# EAGLE design HEAT (EAGLE 9.4.2)
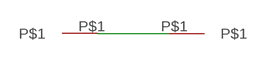
[diagram p0: schematic, sheet 1]

## Parts
U$1  PAD  [PAD]
U$2  PAD  [PAD]

## Nets
N$1: U$1.P$1 U$2.P$1

## Library data of the parts
U$1 U$2 = CanCubeSat:PAD

## Board
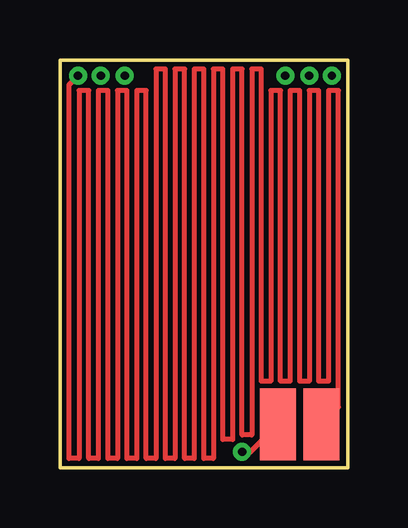
[diagram p1: board, top side]
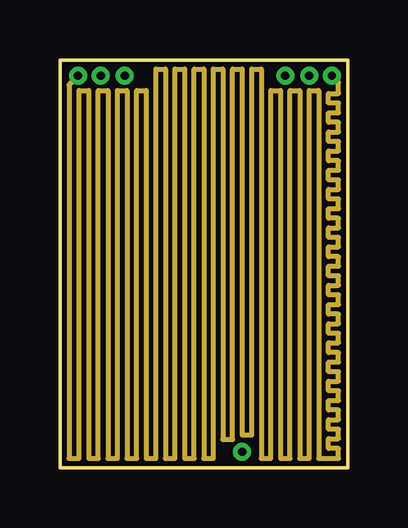
[diagram p2: board, inner layer Route2]
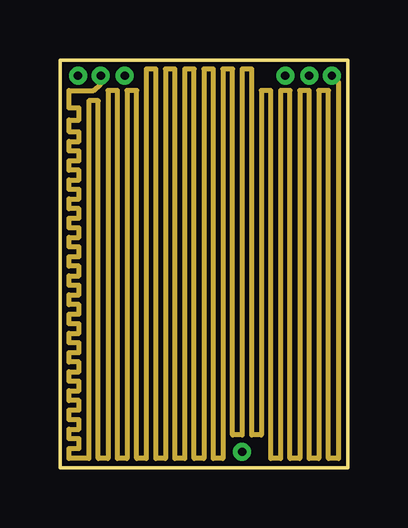
[diagram p3: board, inner layer Route3]
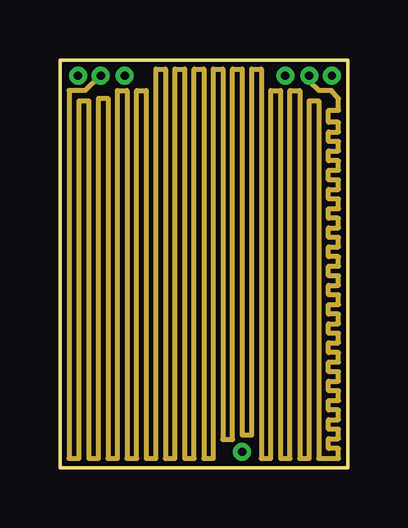
[diagram p4: board, inner layer Route4]
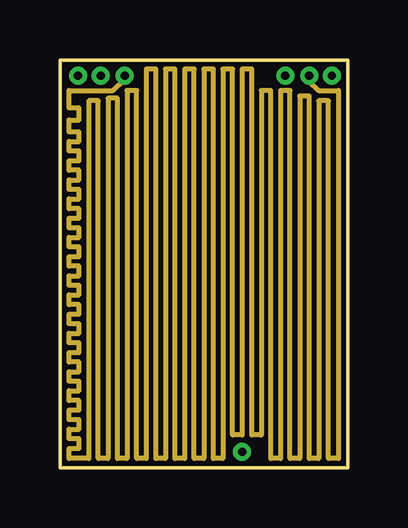
[diagram p5: board, inner layer Route5]
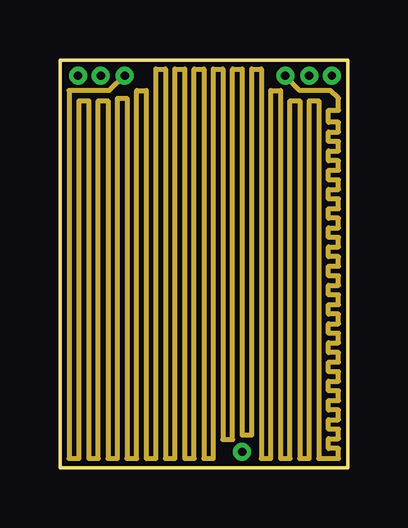
[diagram p6: board, inner layer Route6]
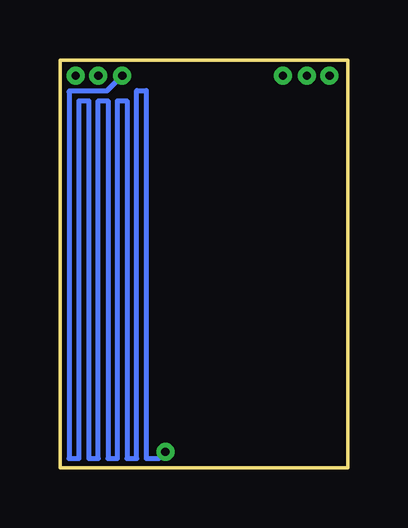
[diagram p7: board, bottom side, seen from below]

Size 12 x 17 mm. Coordinates in mm from the lower left corner, seen from the top.
Outline: 0,0 0,17 12,17 12,0 0,0
Copper layers (1+2+3+4+5+6+16): Top 0.018mm / dielectric 1.5mm / Route2 0.018mm / dielectric 0.15mm / Route3 0.018mm / dielectric 0.2mm / Route4 0.018mm / dielectric 0.15mm / Route5 0.018mm / dielectric 0.2mm / Route6 0.018mm / dielectric 0.15mm / Bottom 0.018mm
Design rules "default *": minimum track width 0.25mil, minimum drill 0.35mm, track to track 0.2mm, track to pad 0.2mm, pad to pad 0.2mm, via to via 0.2mm, smd to smd 0.2mm, copper to edge 0.2mm, drill to drill 0.1mm, minimum pad ring 10mil, minimum via ring 8mil, stop-mask expansion 4mil, vias tented up to drill 0mil, thermal gap 10mil

### Footprints (pad centres in the part's own frame; a part is rotated, then mirrored left to right if it is on the bottom)
PAD = smd 1.5 x 3: P$1 0,0

### Placement (x,y rotation side)
U$1  10.9,1.8 0 top
U$2  9.1,1.8 0 top

### Tracks (layer width: path | path; a pad name or v marks a point on that pad's centre or on a via)
N$1  (via drill 0.35)
  Top 0.2: U$1.P$1 11.62,2.52 11.62,15.72 11.2,15.72 11.2,3.6 10.8,3.6 10.8,15.72 10.4,15.72 10.4,3.6 10,3.6 10,15.72 9.6,15.72 9.6,3.6 9.2,3.6 9.2,15.72 8.8,15.72 8.8,3.6 8.4,3.6 8.4,16.62 8,16.62 8,1.36 7.6,1.36 7.6,16.62 7.2,16.62 7.2,1.18 6.8,1.18 6.8,16.62 6.4,16.62 6.4,0.38 6,0.38 6,16.62 5.6,16.62 5.6,0.38 5.2,0.38 5.2,16.62 4.8,16.62 4.8,0.38 4.4,0.38 4.4,16.62 4,16.62 4,0.38 3.6,0.38 3.6,15.72 3.2,15.72 3.2,0.38 2.8,0.38 2.8,15.72 2.4,15.72 2.4,0.38 2,0.38 2,15.72 1.6,15.72 1.6,0.38 1.2,0.38 1.2,15.72 0.8,15.72 0.8,0.38 0.38,0.38 0.38,15.97 v0.75,16.35 | v7.6,0.65 7.95,0.65 U$2.P$1
  Route2 0.2: v0.75,16.35 0.38,15.97 0.38,0.38 0.8,0.38 0.8,15.72 1.2,15.72 1.2,0.38 1.6,0.38 1.6,15.72 2,15.72 2,0.38 2.4,0.38 2.4,15.72 2.8,15.72 2.8,0.38 3.2,0.38 3.2,15.72 3.6,15.72 3.6,0.38 4,0.38 4,16.62 4.4,16.62 4.4,0.38 4.8,0.38 4.8,16.62 5.2,16.62 5.2,0.38 5.6,0.38 5.6,16.62 6,16.62 6,0.38 6.4,0.38 6.4,16.62 6.8,16.62 6.8,1.18 7.2,1.18 7.2,16.62 7.6,16.62 7.6,1.36 8,1.36 8,16.62 8.4,16.62 8.4,0.38 8.8,0.38 8.8,15.72 9.2,15.72 9.2,0.38 9.6,0.38 9.6,15.72 10,15.72 10,0.38 10.4,0.38 10.4,15.72 10.8,15.72 10.8,0.38 11.62,0.38 11.62,0.8 11.2,0.8 11.2,1.2 11.62,1.2 11.62,1.6 11.2,1.6 11.2,2 11.62,2 11.62,2.4 11.2,2.4 11.2,2.8 11.62,2.8 11.62,3.2 11.2,3.2 11.2,3.6 11.62,3.6 11.62,4 11.2,4 11.2,4.4 11.62,4.4 11.62,4.8 11.2,4.8 11.2,5.2 11.62,5.2 11.62,5.6 11.2,5.6 11.2,6 11.62,6 11.62,6.4 11.2,6.4 11.2,6.8 11.62,6.8 11.62,7.2 11.2,7.2 11.2,7.6 11.62,7.6 11.62,8 11.2,8 11.2,8.4 11.62,8.4 11.62,8.8 11.2,8.8 11.2,9.2 11.62,9.2 11.62,9.6 11.2,9.6 11.2,10 11.62,10 11.62,10.4 11.2,10.4 11.2,10.8 11.62,10.8 11.62,11.2 11.2,11.2 11.2,11.6 11.62,11.6 11.62,12 11.2,12 11.2,12.4 11.62,12.4 11.62,12.8 11.2,12.8 11.2,13.2 11.62,13.2 11.62,13.6 11.2,13.6 11.2,14 11.62,14 11.62,14.4 11.2,14.4 11.2,14.8 11.62,14.8 11.62,15.2 11.2,15.2 11.2,15.6 11.62,15.6 11.62,16.07 v11.35,16.35
  Route3 0.2: v11.35,16.35 11.62,16.07 11.62,0.38 11.2,0.38 11.2,15.72 10.8,15.72 10.8,0.38 10.4,0.38 10.4,15.72 10,15.72 10,0.38 9.6,0.38 9.6,15.72 9.2,15.72 9.2,0.38 8.8,0.38 8.8,15.72 8.4,15.72 8.4,1.36 8,1.36 8,16.62 7.6,16.62 7.6,1.36 7.2,1.36 7.2,16.62 6.8,16.62 6.8,0.38 6.4,0.38 6.4,16.62 6,16.62 6,0.38 5.6,0.38 5.6,16.62 5.2,16.62 5.2,0.38 4.8,0.38 4.8,16.62 4.4,16.62 4.4,0.38 4,0.38 4,16.62 3.6,16.62 3.6,0.38 3.2,0.38 3.2,15.72 2.8,15.72 2.8,0.38 2.4,0.38 2.4,15.72 2,15.72 2,0.38 1.6,0.38 1.6,15.3 1.2,15.3 1.2,0.38 0.38,0.38 0.38,0.8 0.8,0.8 0.8,1.2 0.38,1.2 0.38,1.6 0.8,1.6 0.8,2 0.38,2 0.38,2.4 0.8,2.4 0.8,2.8 0.38,2.8 0.38,3.2 0.8,3.2 0.8,3.6 0.38,3.6 0.38,4 0.8,4 0.8,4.4 0.38,4.4 0.38,4.8 0.8,4.8 0.8,5.2 0.38,5.2 0.38,5.6 0.8,5.6 0.8,6 0.38,6 0.38,6.4 0.8,6.4 0.8,6.8 0.38,6.8 0.38,7.2 0.8,7.2 0.8,7.6 0.38,7.6 0.38,8 0.8,8 0.8,8.4 0.38,8.4 0.38,8.8 0.8,8.8 0.8,9.2 0.38,9.2 0.38,9.6 0.8,9.6 0.8,10 0.38,10 0.38,10.4 0.8,10.4 0.8,10.8 0.38,10.8 0.38,11.2 0.8,11.2 0.8,11.6 0.38,11.6 0.38,12 0.8,12 0.8,12.4 0.38,12.4 0.38,12.8 0.8,12.8 0.8,13.2 0.38,13.2 0.38,13.6 0.8,13.6 0.8,14 0.4,14 0.38,14.02 0.38,14.5 0.8,14.5 0.8,15 0.38,15 0.38,15.72 1.4,15.72 1.7,16 v1.7,16.35
  Route4 0.2: v1.7,16.35 1.05,15.72 0.38,15.72 0.38,0.38 0.8,0.38 0.8,15.3 1.2,15.3 1.2,0.38 1.6,0.38 1.6,15.4 2,15.4 2,0.38 2.4,0.38 2.4,15.72 2.8,15.72 2.8,0.38 3.2,0.38 3.2,15.72 3.6,15.72 3.6,0.38 4,0.38 4,16.62 4.4,16.62 4.4,0.38 4.8,0.38 4.8,16.62 5.2,16.62 5.2,0.38 5.6,0.38 5.6,16.62 6,16.62 6,0.38 6.4,0.38 6.4,16.62 6.8,16.62 6.8,1.18 7.2,1.18 7.2,16.62 7.6,16.62 7.6,1.36 8,1.36 8,16.62 8.4,16.62 8.4,0.38 8.8,0.38 8.8,15.72 9.2,15.72 9.2,0.38 9.6,0.38 9.6,15.72 10,15.72 10,0.38 10.4,0.38 10.4,15.3 10.8,15.3 10.8,0.38 11.62,0.38 11.62,0.8 11.2,0.8 11.2,1.2 11.62,1.2 11.62,1.6 11.2,1.6 11.2,2 11.62,2 11.62,2.4 11.2,2.4 11.2,2.8 11.62,2.8 11.62,3.2 11.2,3.2 11.2,3.6 11.62,3.6 11.62,4 11.2,4 11.2,4.4 11.62,4.4 11.62,4.8 11.2,4.8 11.2,5.2 11.62,5.2 11.62,5.6 11.2,5.6 11.2,6 11.62,6 11.62,6.4 11.2,6.4 11.2,6.8 11.62,6.8 11.62,7.2 11.2,7.2 11.2,7.6 11.62,7.6 11.62,8 11.2,8 11.2,8.4 11.62,8.4 11.62,8.8 11.2,8.8 11.2,9.2 11.62,9.2 11.62,9.6 11.2,9.6 11.2,10 11.62,10 11.62,10.4 11.2,10.4 11.2,10.8 11.62,10.8 11.62,11.2 11.2,11.2 11.2,11.6 11.62,11.6 11.62,12 11.2,12 11.2,12.4 11.62,12.4 11.62,12.8 11.2,12.8 11.2,13.2 11.62,13.2 11.62,13.6 11.2,13.6 11.2,14 11.62,14 11.62,14.4 11.2,14.4 11.2,14.9 11.62,14.9 11.62,15.4 11.32,15.72 10.8,15.72 10.4,16.1 v10.4,16.35
  Route5 0.2: v10.4,16.35 10.4,16.1 10.8,15.72 11.62,15.72 11.62,0.38 11.2,0.38 11.2,15.3 10.8,15.3 10.8,0.38 10.4,0.38 10.4,15.5 10,15.5 10,0.38 9.6,0.38 9.6,15.72 9.2,15.72 9.2,0.38 8.8,0.38 8.8,15.72 8.4,15.72 8.4,1.36 8,1.36 8,16.62 7.6,16.62 7.6,1.36 7.2,1.36 7.2,16.62 6.8,16.62 6.8,0.38 6.4,0.38 6.4,16.62 6,16.62 6,0.38 5.6,0.38 5.6,16.62 5.2,16.62 5.2,0.38 4.8,0.38 4.8,16.62 4.4,16.62 4.4,0.38 4,0.38 4,16.62 3.6,16.62 3.6,0.38 3.2,0.38 3.2,15.72 2.8,15.72 2.8,0.38 2.4,0.38 2.4,15.4 2,15.4 2,0.38 1.6,0.38 1.6,15.3 1.2,15.3 1.2,0.38 0.38,0.38 0.38,0.8 0.8,0.8 0.8,1.2 0.38,1.2 0.38,1.6 0.8,1.6 0.8,2 0.38,2 0.38,2.4 0.8,2.4 0.8,2.8 0.38,2.8 0.38,3.2 0.8,3.2 0.8,3.6 0.38,3.6 0.38,4 0.8,4 0.8,4.4 0.38,4.4 0.38,4.8 0.8,4.8 0.8,5.2 0.38,5.2 0.38,5.6 0.8,5.6 0.8,6 0.38,6 0.38,6.4 0.8,6.4 0.8,6.8 0.38,6.8 0.38,7.2 0.8,7.2 0.8,7.6 0.38,7.6 0.38,8 0.8,8 0.8,8.4 0.38,8.4 0.38,8.8 0.8,8.8 0.8,9.2 0.38,9.2 0.38,9.6 0.8,9.6 0.8,10 0.38,10 0.38,10.4 0.8,10.4 0.8,10.8 0.38,10.8 0.38,11.2 0.8,11.2 0.8,11.6 0.38,11.6 0.38,12 0.8,12 0.8,12.4 0.38,12.4 0.38,12.8 0.8,12.8 0.8,13.2 0.38,13.2 0.38,13.6 0.8,13.6 0.8,14 0.38,14 0.38,14.5 0.8,14.5 0.8,15 0.38,15 0.38,15.72 2.2,15.72 2.7,16.2 v2.7,16.35
  Route6 0.2: v2.7,16.35 2.05,15.72 0.38,15.72 0.38,0.38 0.8,0.38 0.8,15.3 1.2,15.3 1.2,0.38 1.6,0.38 1.6,15.3 2,15.3 2,0.38 2.4,0.38 2.4,15.4 2.8,15.4 2.8,0.38 3.2,0.38 3.2,15.72 3.6,15.72 3.6,0.38 4,0.38 4,16.62 4.4,16.62 4.4,0.38 4.8,0.38 4.8,16.62 5.2,16.62 5.2,0.38 5.6,0.38 5.6,16.62 6,16.62 6,0.38 6.4,0.38 6.4,16.62 6.8,16.62 6.8,1.18 7.2,1.18 7.2,16.62 7.6,16.62 7.6,1.36 8,1.36 8,16.62 8.4,16.62 8.4,0.38 8.8,0.38 8.8,15.72 9.2,15.72 9.2,0.38 9.6,0.38 9.6,15.3 10,15.3 10,0.38 10.4,0.38 10.4,15.3 10.8,15.3 10.8,0.38 11.62,0.38 11.62,0.8 11.2,0.8 11.2,1.2 11.62,1.2 11.62,1.6 11.2,1.6 11.2,2 11.62,2 11.62,2.4 11.2,2.4 11.2,2.8 11.62,2.8 11.62,3.2 11.2,3.2 11.2,3.6 11.62,3.6 11.62,4 11.2,4 11.2,4.4 11.62,4.4 11.62,4.8 11.2,4.8 11.2,5.2 11.62,5.2 11.62,5.6 11.2,5.6 11.2,6 11.62,6 11.62,6.4 11.2,6.4 11.2,6.8 11.62,6.8 11.62,7.2 11.2,7.2 11.2,7.6 11.62,7.6 11.62,8 11.2,8 11.2,8.4 11.62,8.4 11.62,8.8 11.2,8.8 11.2,9.2 11.62,9.2 11.62,9.6 11.2,9.6 11.2,10 11.62,10 11.62,10.4 11.2,10.4 11.2,10.8 11.62,10.8 11.62,11.2 11.2,11.2 11.2,11.6 11.62,11.6 11.62,12 11.2,12 11.2,12.4 11.62,12.4 11.62,12.8 11.2,12.8 11.2,13.2 11.62,13.2 11.62,13.6 11.2,13.6 11.2,14 11.62,14 11.62,14.4 11.2,14.4 11.2,14.9 11.62,14.9 11.62,15.4 11.28,15.72 10,15.72 v9.4,16.35
  Bottom 0.2: v9.4,16.35 10.05,15.7 11.6,15.7 11.62,15.68 11.62,0.38 11.2,0.38 11.2,15.3 10.8,15.3 10.8,0.38 10.4,0.38 10.4,15.3 10,15.3 10,0.38 9.6,0.38 9.6,15.3 9.2,15.3 9.2,0.38 8.8,0.38 8.8,15.72 8.4,15.72 8.4,0.38 7.88,0.38 v7.6,0.65